# EAGLE design textdisplay (EAGLE 7.3.0)
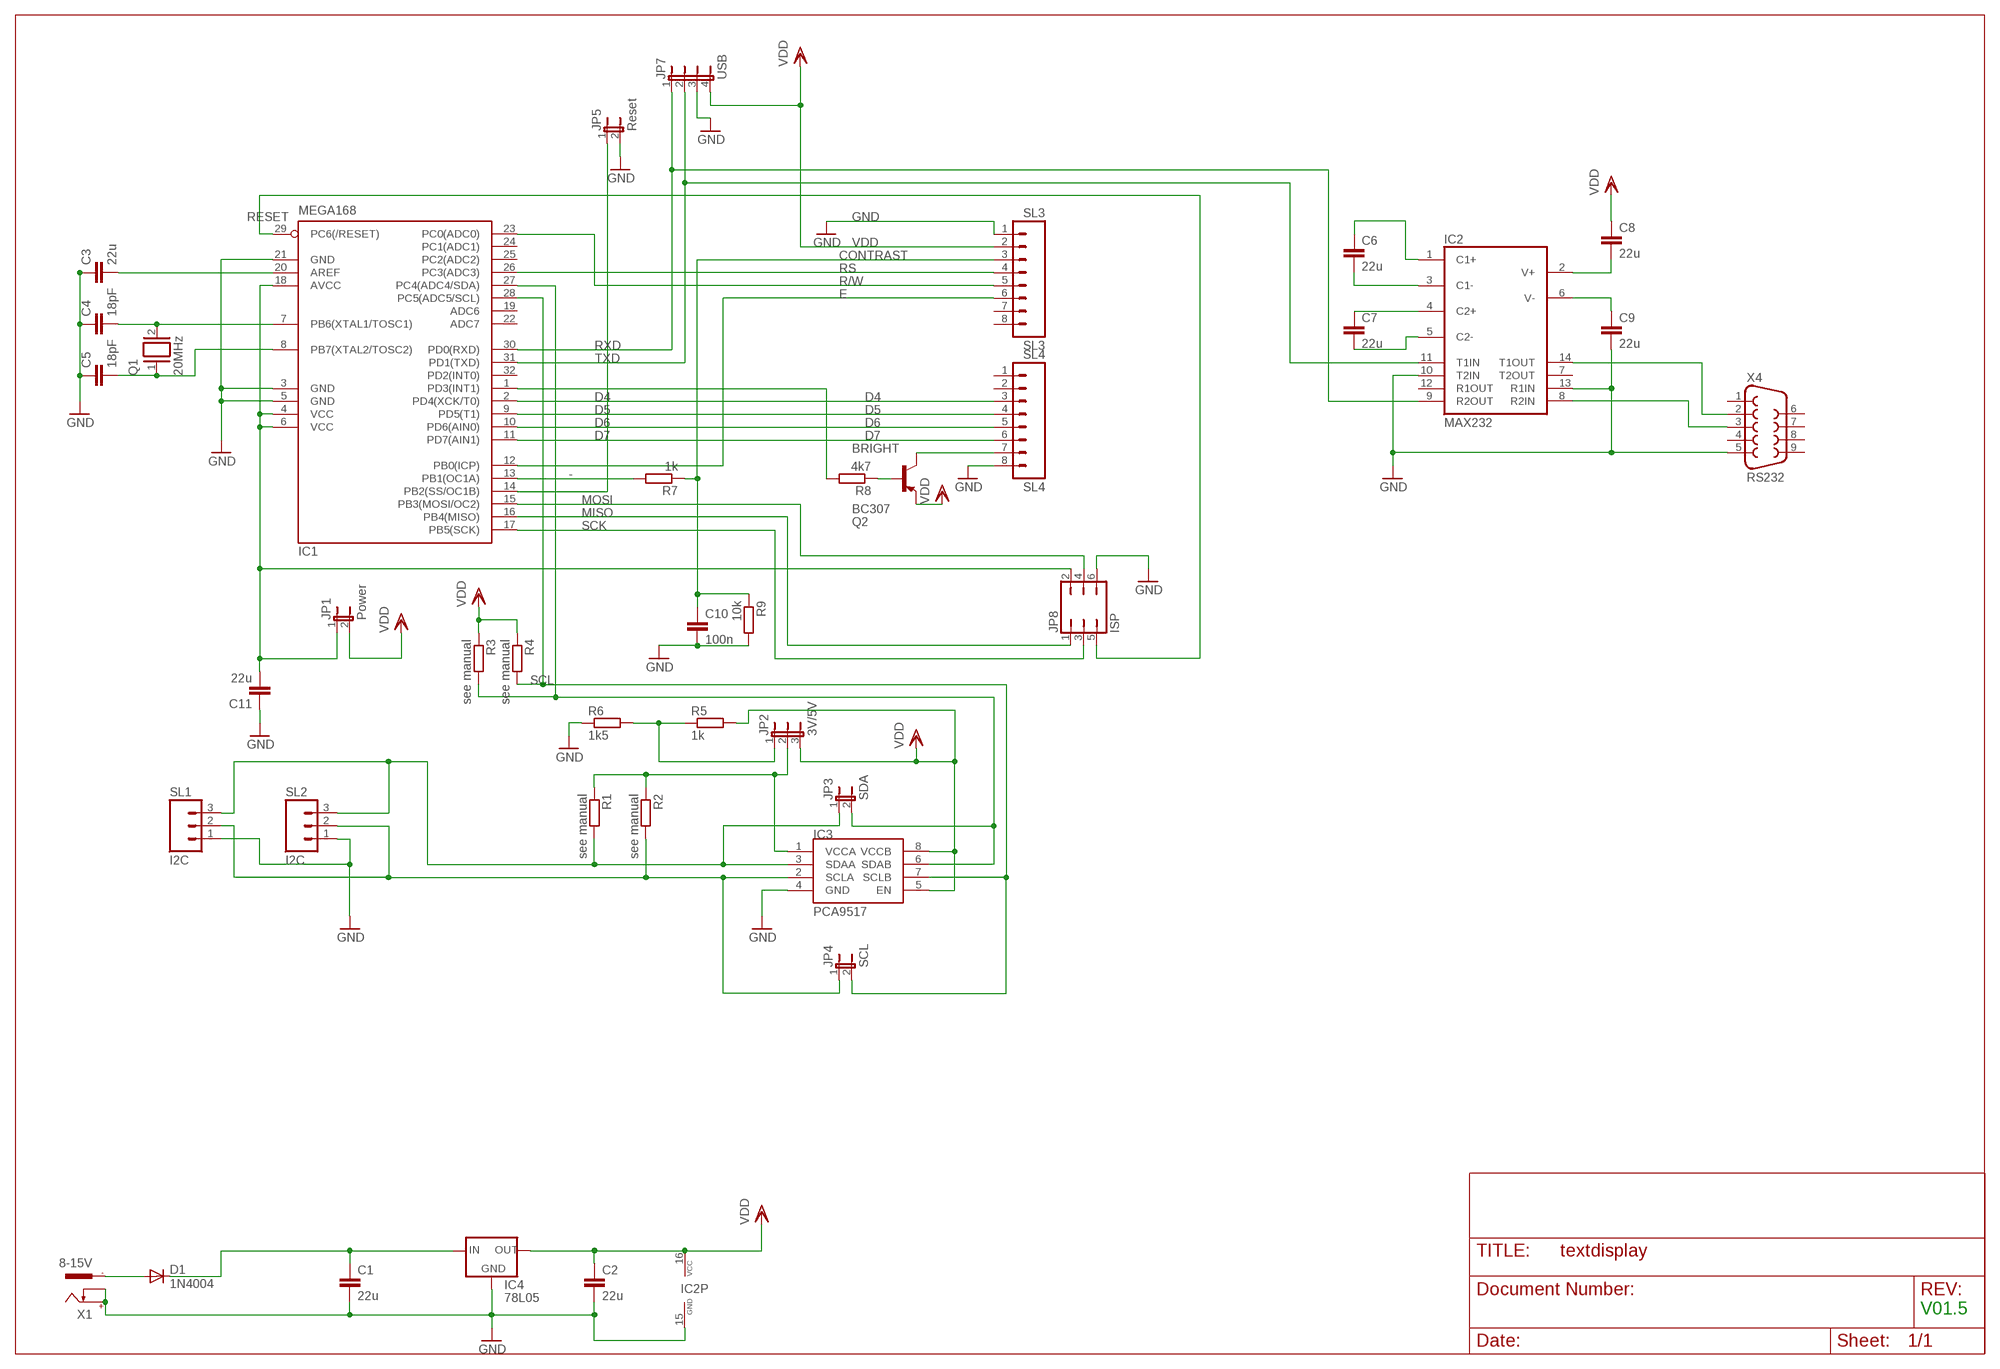
[diagram p0: schematic, sheet 1]

## Parts
C1  22u  C-EUC1206  [C1206]
C2  22u  C-EUC1206  [C1206]
C3  22u  C-EUC1206  [C1206]
C4  18pF  C-EU025-025X050  [C025-025X050]
C5  18pF  C-EU025-025X050  [C025-025X050]
C6  22u  C-EUC1206  [C1206]
C7  22u  C-EUC1206  [C1206]
C8  22u  C-EUC1206  [C1206]
C9  22u  C-EUC1206  [C1206]
C10  100n  C-EU050-025X075  [C050-025X075]
C11  22u  C-EUC1206  [C1206]
D1  1N4004  [DO41-10]
IC1  MEGA168  MEGA8-AI  [TQFP32-08]
IC2  MAX232  [DIL16]
IC3  PCA9517  [SO-08]
IC4  78L05  78LXX  [78LXX]
JP1  Power  JP1E  [JP1]
JP2  3V/5V  JP2E  [JP2]
JP3  SDA  JP1E  [JP1]
JP4  SCL  JP1E  [JP1]
JP5  Reset  JP1E  [JP1]
JP7  USB  JP4E  [JP4]
JP8  ISP  JP3Q  [JP3Q]
Q1  20MHz  XTAL/S  [QS]
Q2  BC307  [TO92]
R1  see manual  R-EU_R1206  [R1206]
R2  see manual  R-EU_R1206  [R1206]
R3  see manual  R-EU_R1206  [R1206]
R4  see manual  R-EU_R1206  [R1206]
R5  1k  R-EU_R1206  [R1206]
R6  1k5  R-EU_R1206  [R1206]
R7  1k  R-EU_R1206  [R1206]
R8  4k7  R-EU_R1206  [R1206]
R9  10k  R-EU_R1206  [R1206]
SL1  I2C  M03  [03P]
SL2  I2C  M03  [03P]
SL3  SL3  M08  [08P]
SL4  SL4  M08  [08P]
X1  8-15V  737992-55  [737992-5]
X4  RS232  F09H  [F09H]

## Nets
-: IC1.13(PB1(OC1A)) R7.2
BRIGHT: Q2.3(C) SL4.7
CONTRAST: C10.1 R7.1 R9.1 SL3.3
D4: IC1.2(PD4(XCK/T0)) SL4.3
D5: IC1.9(PD5(T1)) SL4.4
D6: IC1.10(PD6(AIN0)) SL4.5
D7: IC1.11(PD7(AIN1)) SL4.6
E: IC1.12(PB0(ICP)) SL3.6
GND: C1.2 C2.2 C3.1 C4.1 C5.1 C9.2 C10.2 C11.1 IC1.3(GND) IC1.5(GND) IC1.21(GND) IC2.10(T2IN) IC2.13(R1IN) IC2.15(GND) IC3.4(GND) IC4.GND JP5.2 JP7.3 JP8.6 R6.1 R9.2 SL1.1 SL2.1 SL3.1 SL4.8 X1.+ X1.K X4.5
MISO: IC1.16(PB4(MISO)) JP8.1
MOSI: IC1.15(PB3(MOSI/OC2)) JP8.4
N$1: JP2.1 R5.1 R6.2
N$2: IC1.1(PD3(INT1)) R8.2
N$3: IC3.3(SDAA) JP3.1 R1.2 SL1.3 SL2.3
N$4: Q2.2(B) R8.1
N$5: IC3.2(SCLA) JP4.1 R2.2 SL1.2 SL2.2
N$6: C11.2 IC1.4(VCC) IC1.6(VCC) IC1.18(AVCC) JP1.1 JP8.2
N$7: C6.2 IC2.3(C1-)
N$8: C7.1 IC2.4(C2+)
N$9: C7.2 IC2.5(C2-)
N$11: C9.1 IC2.6(V-)
N$12: C8.2 IC2.2(V+)
N$13: C6.1 IC2.1(C1+)
N$14: IC2.8(R2IN) X4.3
N$15: IC2.14(T1OUT) X4.2
N$16: IC1.14(PB2(SS/OC1B)) JP5.1
N$18: C1.1 D1.C IC4.IN
N$19: C4.2 IC1.7(PB6(XTAL1/TOSC1)) Q1.2
N$24: IC3.1(VCCA) JP2.2 R1.1 R2.1
N$25: D1.A X1.-1
N$35: C3.2 IC1.20(AREF)
N$37: C5.2 IC1.8(PB7(XTAL2/TOSC2)) Q1.1
R/W: IC1.23(PC0(ADC0)) SL3.5
RESET: IC1.29(PC6(/RESET)) JP8.5
RS: IC1.26(PC3(ADC3)) SL3.4
RXD: IC1.30(PD0(RXD)) IC2.9(R2OUT) JP7.1
SCK: IC1.17(PB5(SCK)) JP8.3
SCL: IC1.28(PC5(ADC5/SCL)) IC3.7(SCLB) JP4.2 R4.2
SDA: IC1.27(PC4(ADC4/SDA)) IC3.6(SDAB) JP3.2 R3.2
TXD: IC1.31(PD1(TXD)) IC2.11(T1IN) JP7.2
VDD: C2.1 C8.1 IC2.16(VCC) IC3.5(EN) IC3.8(VCCB) IC4.OUT JP1.2 JP2.3 JP7.4 Q2.1(E) R3.1 R4.1 R5.2 SL3.2
Unconnected: IC1.19(ADC6) IC1.22(ADC7) IC1.24(PC1(ADC1)) IC1.25(PC2(ADC2)) IC1.32(PD2(INT0)) IC2.7(T2OUT) IC2.12(R1OUT) SL3.7 SL3.8 SL4.1 SL4.2 X1.-2 X4.1 X4.4 X4.6 X4.7 X4.8 X4.9

## Notes on the sheet
- V01.5

## Library data of the parts
C1-C11 = resistor:C-EU: CAPACITOR, European symbol
D1 = diode:1N4004: DIODE general purpose rectifier, 1 A
IC1 = atmel:MEGA8: MICROCONTROLLER 8 Kbytes FLASH, 1 kbytes SRAM, 512 bytes EEPROM, USART, 6-channel 10 bit ADC, 2-channel 8 bit ADC Pin compatible with Atmega48, ATMega88, ATMega168 Source: avr.lbr; MPN: ATMEGA8-16AU; OC_FARNELL: 9171371; OC_NEWARK: 73M8863
IC2 = maxim:MAX232: RS232 TRANSCEIVER; MF: MAXIM; MPN: MAX232ACPE+; OC_FARNELL: 9723773; OC_NEWARK: 68K4544
IC3 = PCA9517:PCA9517: PCA9517
IC4 = v-reg:78LXX: VOLTAGE REGULATOR
JP1 JP3-JP5 = jumper:JP1E: JUMPER
JP2 = jumper:JP2E: JUMPER
JP7 = jumper:JP4E: JUMPER
JP8 = jumper:JP3Q: JUMPER
Q1 = special:XTAL/S: CRYSTAL
Q2 = transistor-pnp:BC307: PNP Transistor
R1-R9 = resistor:R-EU_: RESISTOR, European symbol
SL1 SL2 = con-amp-quick:M03: AMP QUICK CONNECTOR; OC_FARNELL: unknown; OC_NEWARK: unknown
SL3 SL4 = con-amp-quick:M08: AMP QUICK CONNECTOR; OC_FARNELL: unknown; OC_NEWARK: unknown
X1 = con-conrad:737992-55: FEMALE PRINT CONNECTOR DIN 45323 (34V/3A), ROKA, distributor Conrad
X4 = con-subd:F09: SUB-D; OC_FARNELL: unknown; OC_NEWARK: unknown

## Board
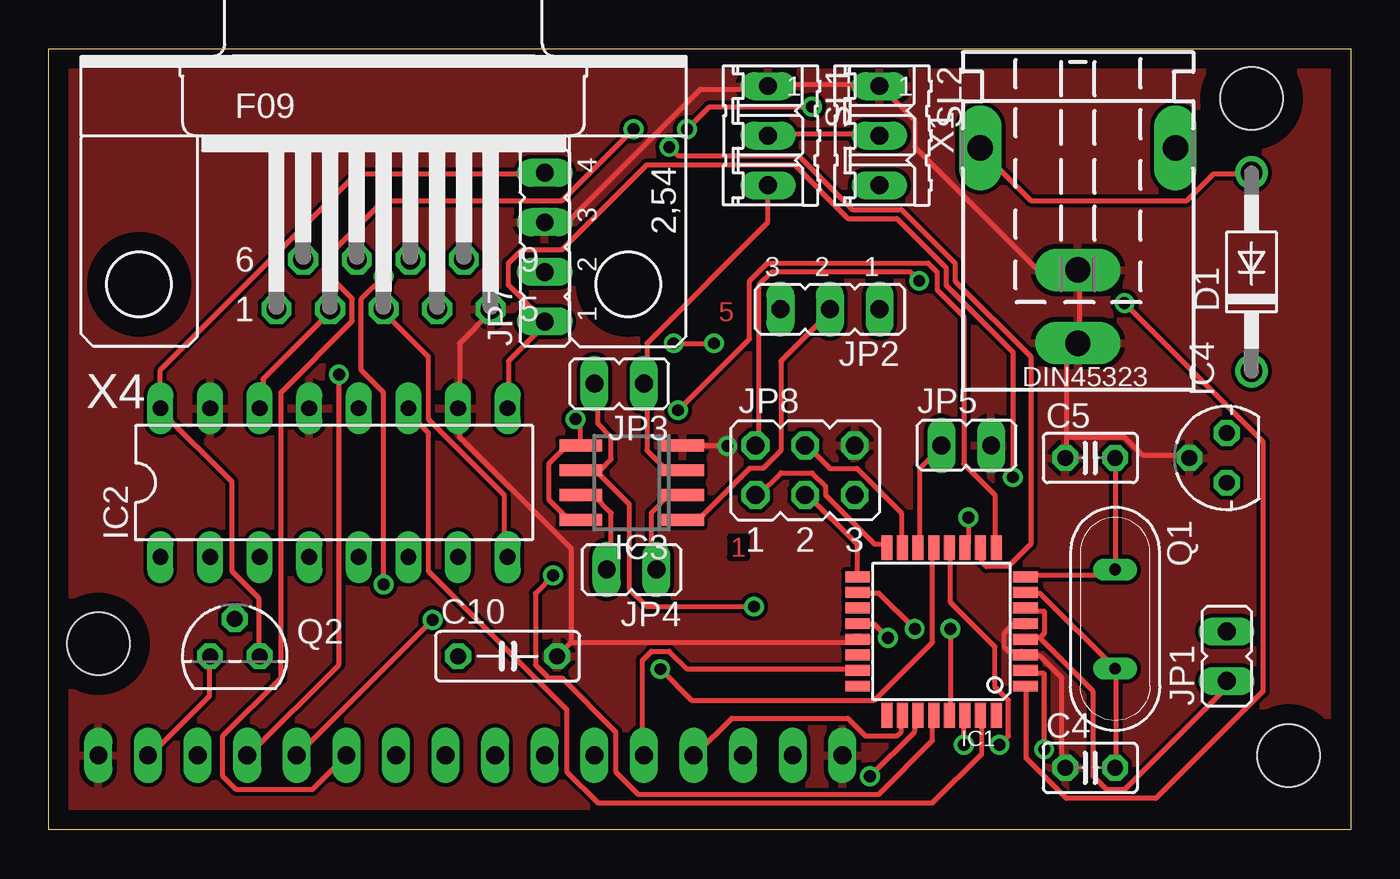
[diagram p1: board, top side]
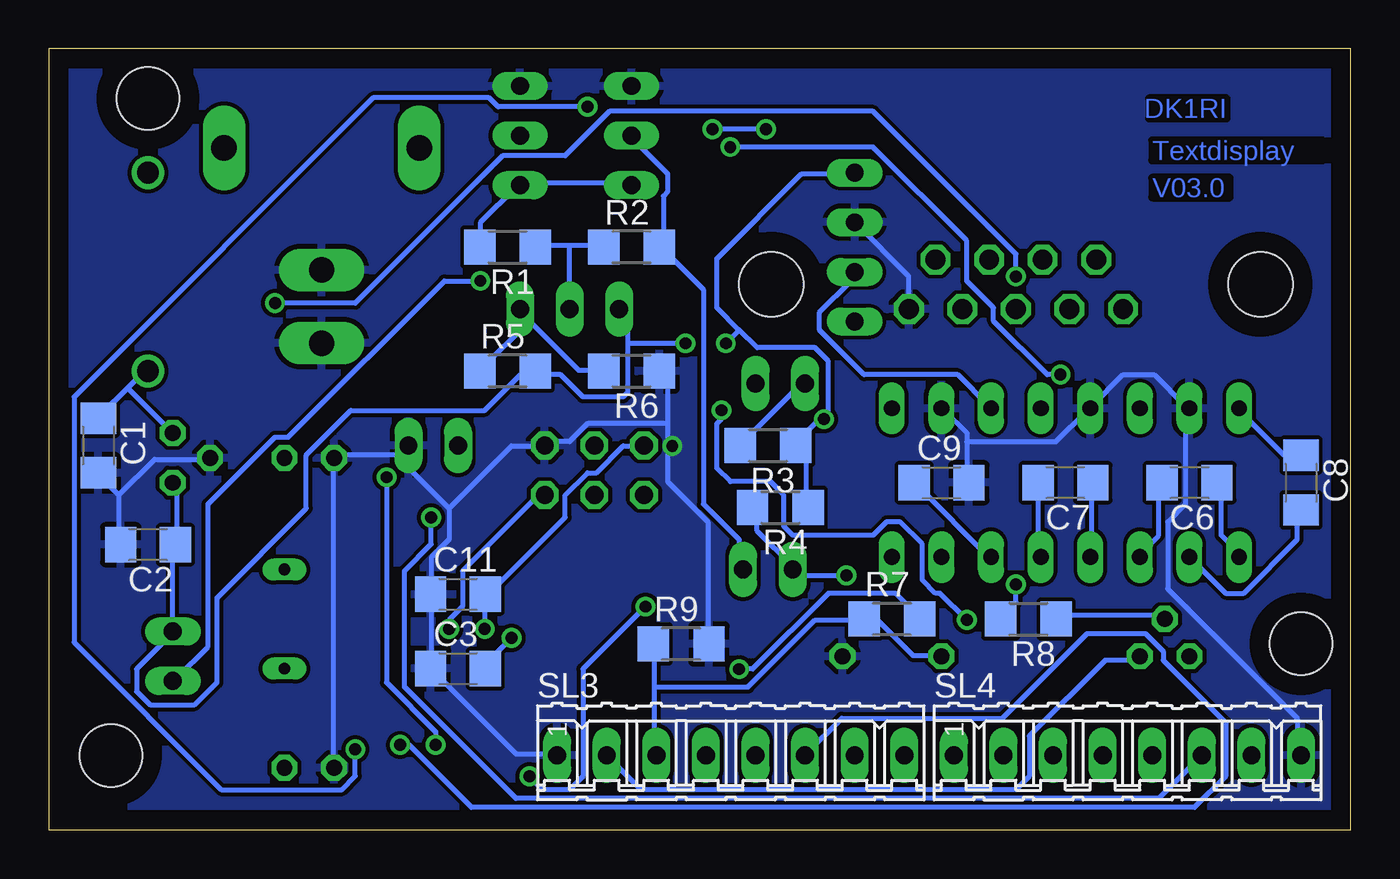
[diagram p2: board, bottom side, seen from below]

Size 66.67 x 40.01 mm. Coordinates in mm from the lower left corner, seen from the top.
Outline: 0,0 0,40.01 66.67,40.01 66.67,0 0,0
Copper layers (1*16): Top 0.035mm / dielectric 1.5mm / Bottom 0.035mm
Design rules "default": minimum track width 10mil, minimum drill 24mil, track to track 8mil, track to pad 8mil, pad to pad 8mil, via to via 8mil, smd to smd 8mil, copper to edge 40mil, drill to drill 8mil, minimum pad ring 10mil, minimum via ring 8mil, stop-mask expansion 4mil, vias tented up to drill 0mil, thermal gap 10mil
Holes 3.2 mm at 63.5,3.81 2.54,9.53 61.59,37.47

### Footprints (pad centres in the part's own frame; a part is rotated, then mirrored left to right if it is on the bottom)
C1206 = smd 1.6 x 1.8: 1 -1.4,0; 2 1.4,0
C025-025X050 = drill 0.813 octagon: 1 -1.27,0; 2 1.27,0
C050-025X075 = drill 0.813 octagon: 1 -2.54,0; 2 2.54,0
DO41-10 = drill 1.118: A 5.08,0; C -5.08,0
TQFP32-08 = smd 1.27 x 0.559: 1 -4.293,2.8; 2 -4.293,2; 3 -4.293,1.2; 4 -4.293,0.4; 5 -4.293,-0.4; 6 -4.293,-1.2; 7 -4.293,-2; 8 -4.293,-2.8; 17 4.293,-2.8; 18 4.293,-2; 19 4.293,-1.2; 20 4.293,-0.4; 21 4.293,0.4; 22 4.293,1.2; 23 4.293,2; 24 4.293,2.8 | smd 0.559 x 1.27: 9 -2.8,-4.293; 10 -2,-4.293; 11 -1.2,-4.293; 12 -0.4,-4.293; 13 0.4,-4.293; 14 1.2,-4.293; 15 2,-4.293; 16 2.8,-4.293; 25 2.8,4.293; 26 2,4.293; 27 1.2,4.293; 28 0.4,4.293; 29 -0.4,4.293; 30 -1.2,4.293; 31 -2,4.293; 32 -2.8,4.293
DIL16 = drill 0.813 long: 1 -8.89,-3.81; 2 -6.35,-3.81; 3 -3.81,-3.81; 4 -1.27,-3.81; 5 1.27,-3.81; 6 3.81,-3.81; 7 6.35,-3.81; 8 8.89,-3.81; 9 8.89,3.81; 10 6.35,3.81; 11 3.81,3.81; 12 1.27,3.81; 13 -1.27,3.81; 14 -3.81,3.81; 15 -6.35,3.81; 16 -8.89,3.81
SO-08 = smd 0.6 x 2.2: 1 -1.905,-2.6; 2 -0.635,-2.6; 3 0.635,-2.6; 4 1.905,-2.6; 5 1.905,2.6; 6 0.635,2.6; 7 -0.635,2.6; 8 -1.905,2.6
78LXX = drill 0.813 octagon: GND 0,1.905; IN 1.27,0; OUT -1.27,0
JP1 = drill 0.914 long: 1 0,-1.27; 2 0,1.27
JP2 = drill 0.914 long: 1 -2.54,0; 2 0,0; 3 2.54,0
JP4 = drill 0.914 long: 1 -3.81,0; 2 -1.27,0; 3 1.27,0; 4 3.81,0
JP3Q = drill 0.914 octagon: 1 -2.54,-1.27; 2 -2.54,1.27; 3 0,-1.27; 4 0,1.27; 5 2.54,-1.27; 6 2.54,1.27
QS = drill 0.61 long: 1 -2.54,0; 2 2.54,0
TO92 = drill 0.813 octagon: 1 1.27,0; 2 0,1.905; 3 -1.27,0
R1206 = smd 1.6 x 1.803: 1 -1.422,0; 2 1.422,0
03P = drill 0.914 long: 1 -2.54,0; 2 0,0; 3 2.54,0
08P = drill 0.914 long: 1 -8.89,0; 2 -6.35,0; 3 -3.81,0; 4 -1.27,0; 5 1.27,0; 6 3.81,0; 7 6.35,0; 8 8.89,0
737992-5 = drill 1.3 pad 2.184 long: + 0,10; -1 5,0; -2 -5,0; K 0,6.25
F09H = drill 1.016 octagon: 1 -5.486,-1.27; 2 -2.743,-1.27; 3 0,-1.27; 4 2.743,-1.27; 5 5.486,-1.27; 6 -4.115,1.27; 7 -1.372,1.27; 8 1.372,1.27; 9 4.115,1.27 | hole 3.302: -12.522,0; 12.522,0

### Placement (x,y rotation side)
C1  64.14,19.68 270 bottom
C2  61.59,14.61 180 bottom
C3  45.72,8.26 0 bottom
C4  53.34,3.17 0 top
C5  53.34,19.05 0 top
C6  8.26,17.78 180 bottom
C7  14.61,17.78 180 bottom
C8  2.54,17.78 270 bottom
C9  20.95,17.78 0 bottom
C10  23.5,8.89 0 top
C11  45.72,12.06 0 bottom
D1  61.59,28.57 90 top
IC1  45.72,10.16 180 top
IC2  14.61,17.78 0 top
IC3  29.84,17.78 90 top
IC4  60.33,19.05 90 top
JP1  60.33,8.89 0 top
JP2  40.01,26.67 180 top
JP3  29.21,22.86 90 top
JP4  29.84,13.34 90 top
JP5  46.99,19.68 270 top
JP7  25.4,29.84 90 top
JP8  38.73,18.41 0 top
Q1  54.61,10.79 270 top
Q2  9.53,8.89 0 top
R1  43.18,29.84 180 bottom
R2  36.83,29.84 0 bottom
R3  29.84,19.68 180 bottom
R4  29.21,16.51 180 bottom
R5  43.18,23.5 0 bottom
R6  36.83,23.5 180 bottom
R7  23.5,10.79 0 bottom
R8  16.51,10.79 180 bottom
R9  34.29,9.53 0 bottom
SL1  36.83,35.56 270 top
SL2  42.55,35.56 270 top
SL3  31.75,3.81 0 bottom
SL4  11.43,3.81 0 bottom
X1  52.7,34.92 180 top
X4  17.14,27.94 0 top

### Tracks (layer width: path | path; a pad name or v marks a point on that pad's centre or on a via)
-  (via drill 0.61)
  Top 0.254: v31.32,8.23 32.92,6.63 42.29,6.63 45.26,9.6 45.26,14.4 IC1.13
  Bottom 0.254: v31.32,8.23 30.63,8.23 26.75,12.12 23.32,12.12 22.17,10.97 R7.2
BRIGHT
  Top 0.254: Q2.3 8.23,8.69 8.23,6.86 5.26,3.89 SL4.7
CONTRAST
  Bottom 0.254: C10.1 21.03,8.91 22.4,8.91 24.23,10.74 24.69,10.74 R7.1 24.92,10.74 27.43,10.74 30.86,7.32 35.66,7.32 | 35.66,7.32 35.66,3.89 SL3.3 | 35.66,7.32 35.66,9.37 R9.1
D4  (via drill 0.61)
  Top 0.254: v50.98,4.12 50.98,8 50.06,8 IC1.2 | v39.09,37.03 33.83,37.03 v32.69,35.89 | v29.95,35.89 26.29,32.23 17.14,32.23 14.63,29.72 14.63,28.12 15.54,27.2 15.54,26.06 11.89,22.4 11.89,7.77 8.91,4.8 8.91,2.74 9.6,2.06 13.49,2.06 SL4.3
  Bottom 0.254: v50.98,4.12 50.98,2.74 51.66,2.06 57.84,2.06 65.38,9.6 65.38,22.17 50.06,37.49 44.12,37.49 43.66,37.03 v39.09,37.03 | v29.95,35.89 v32.69,35.89
D5  (via drill 0.61)
  Top 0.254: v32.23,21.49 35.89,25.15 35.89,28.12 36.8,29.03 45.03,29.03 45.49,28.57 45.49,27.66 46.86,26.29 46.86,18.75 48.46,17.14 48.46,14.63 IC1.9 | v19.66,10.74 12.8,3.89 SL4.4
  Bottom 0.254: v32.23,21.49 32.23,21.03 32.46,20.8 32.46,18.52 31.77,17.83 29.72,17.83 29.03,17.14 29.03,15.54 28.57,15.09 24.46,15.09 23.77,15.77 23.09,15.77 21.95,14.63 21.95,12.8 21.26,12.12 21.03,12.12 v19.66,10.74
D6  (via drill 0.61)
  Top 0.254: v31.77,34.98 32.23,34.52 38.41,34.52 41.15,31.77 43.66,31.77 46.41,29.03 46.41,28.12 50.29,24.23 50.29,14.63 49.15,13.49 48.01,13.49 47.78,13.72 47.78,14.4 IC1.10 | v14.86,23.32 14.86,8.46 10.29,3.89 SL4.5
  Bottom 0.254: v31.77,34.98 24.46,34.98 19.66,30.18 19.66,28.12 18.29,26.75 18.29,26.06 15.54,23.32 v14.86,23.32
D7  (via drill 0.61)
  Top 0.254: v47.09,16 47.09,14.63 IC1.11
  Bottom 0.254: v47.09,16 47.09,14.63 48.46,13.26 48.46,7.32 42.75,1.6 9.83,1.6 SL4.6
E  (via drill 0.61)
  Top 0.254: v48.69,4.34 49.15,4.8 49.15,6.63 48.46,7.32 48.46,9.37 46.18,11.66 46.18,14.4 IC1.12
  Bottom 0.254: v48.69,4.34 48.23,4.34 45.03,1.14 8,1.14 6.4,2.74 6.4,5.49 9.6,8.69 9.6,9.14 10.52,10.06 13.49,10.06 17.83,5.71 26.06,5.71 27.89,3.89 SL3.6
GND  (via drill 0.61)
  Top 0.254: v34.75,19.66 32.46,19.66 IC3.4 | IC1.5 49.84,10.52 49.38,10.52 48.92,10.06 48.92,9.37 49.15,9.14 49.84,9.14 IC1.3 50.06,8.91 50.75,8.91 51.89,7.77 51.89,3.2 C4.1 | 52.12,20.12 52.12,24.46 52.58,24.92 X1.+ 52.81,25.15 52.81,28.57 X1.K 52.58,28.8 50.52,28.8 44.35,34.98 44.35,36.35 42.75,37.95 SL2.1 42.52,38.18 37.03,38.18 SL1.1 36.8,37.95 33.38,37.95 26.75,31.32 25.6,31.32 JP7.3 | 52.12,20.12 52.12,19.2 C5.1 | 52.12,20.12 55.09,20.12 56.01,19.2 58.29,19.2 IC4.GND | 26.75,9.6 41.38,9.6 IC1.21 | C10.2 26.75,9.6 | X4.5 22.63,26.52 21.03,24.92 21.03,21.72 IC2.10 21.03,21.49 21.03,20.12 26.75,14.4 26.75,9.6
  Bottom 0.254: 34.98,20.8 34.98,23.09 35.2,23.32 R6.1 | 34.98,20.8 34.98,19.66 | 34.98,19.66 34.98,17.83 32.92,15.77 32.92,9.6 R9.2 | 34.98,19.66 v34.75,19.66 | 34.98,20.8 39.09,20.8 40.01,19.89 41.15,19.89 JP8.6 41.38,19.66 42.98,19.66 46.18,16.46 | SL3.1 40.69,3.89 42.75,3.89 47.09,8.23 C3.1 47.09,8.46 47.09,11.89 C11.1 47.09,12.12 47.09,13.95 46.18,14.86 46.18,16.46 | 63.09,17.14 63.09,14.63 C2.2 | 63.09,17.14 64.01,18.06 C1.2 | 63.09,17.14 61.27,18.97 58.52,18.97 IC4.GND | 48.92,19.2 51.89,19.2 C5.1 52.12,18.97 52.12,3.2 C4.1 | 48.92,19.2 48.46,19.66 JP5.2 48.92,19.2 | 48.92,19.2 46.18,16.46 | SL4.8 2.74,3.89 2.74,5.71 9.37,12.34 9.37,15.77 8.46,16.69 8.46,21.49 IC2.15 8.46,21.72 10.06,23.32 11.66,23.32 13.26,21.72 IC2.13 13.49,21.49 15.09,19.89 19.66,19.89 | 19.66,19.89 19.66,20.34 20.8,21.49 IC2.10 | 19.66,19.89 19.66,17.83 C9.2 | JP7.3 22.63,28.35 X4.5
  pour Top: 0.64,39.37 66.04,39.37 66.04,0.64 0.64,0.64
  pour Bottom: 0.64,39.37 66.04,39.37 66.04,0.64 0.64,0.64
MISO
  Top 0.254: IC1.16 42.75,14.63 42.29,14.63 39.78,17.14 39.78,17.6 39.09,18.29 37.49,18.29 36.35,17.14 JP8.1
MOSI
  Top 0.254: IC1.15 43.66,14.63 43.66,16.23 41.38,18.52 40.01,18.52 38.86,19.66 JP8.4
N$1
  Bottom 0.254: 42.06,26.06 42.52,26.52 JP2.1 42.06,26.06 | 42.06,26.06 39.55,23.55 38.41,23.55 R6.2 | 42.06,26.06 44.58,23.55 R5.1
N$2  (via drill 0.61)
  Top 0.254: v55.09,26.98 62.18,19.89 62.18,7.09 56.69,1.6 52.12,1.6 50.06,3.66 50.06,7.32 IC1.1 | v17.14,28.35 16,27.2 16,23.55 17.14,22.4 v17.14,12.57
  Bottom 0.254: v55.09,26.98 50.98,26.98 43.43,34.52 40.23,34.52 37.95,36.8 24.46,36.8 17.14,29.49 v17.14,28.35 | v17.14,12.57 17.14,11.66 17.83,10.97 R8.2
N$3
  Top 0.254: 30.63,22.86 30.63,19.43 31.55,18.52 32.23,18.52 IC3.3 | 30.63,22.86 30.63,24.92 36.8,31.09 36.8,32.92 SL1.3 | 30.63,22.86 JP3.1
  Bottom 0.254: R1.2 44.58,29.95 44.58,31.09 42.75,32.92 SL2.3 42.52,33.15 37.03,33.15 SL1.3
N$4
  Bottom 0.254: R8.1 15.09,10.97 9.6,10.97 Q2.2
N$5
  Top 0.254: IC3.2 31.77,17.14 30.86,16.23 30.86,13.72 31.09,13.49 JP4.1 | SL2.2 42.52,35.66 37.03,35.66 SL1.2
  Bottom 0.254: SL1.2 36.8,35.43 34.98,33.6 34.98,32.69 35.2,32.46 35.2,29.95 R2.2 35.2,29.72 33.15,27.66 33.15,16.69 31.32,14.86 31.32,13.49 JP4.1
N$6  (via drill 0.61)
  Top 0.254: v44.35,10.29 42.52,12.12 41.6,12.12 IC1.18 | 50.75,9.83 50.06,9.83 IC1.4 | 50.75,9.83 50.98,10.06 50.98,11.2 50.06,11.2 IC1.6 | 50.75,9.83 53.49,7.09 53.49,2.74 54.18,2.06 55.09,2.06 60.12,7.09 60.12,7.54 JP1.1 | v44.58,28.12 44.12,28.57 37.03,28.57 36.35,27.89 36.35,19.89 JP8.2
  Bottom 0.254: v44.35,10.29 44.35,11.89 C11.2 44.12,12.12 40.23,16 40.23,17.14 39.09,18.29 38.63,18.29 37.26,19.66 36.35,19.66 JP8.2 | v44.58,28.12 46.41,28.12 54.41,20.12 55.09,20.12 58.52,16.69 58.52,9.37 60.12,7.77 JP1.1
N$7
  Bottom 0.254: C6.2 9.83,17.6 9.83,15.09 10.74,14.17 IC2.3
N$8
  Bottom 0.254: C7.1 13.26,17.6 13.26,14.17 IC2.4
N$9
  Bottom 0.254: C7.2 16,17.6 16,14.17 IC2.5
N$11
  Bottom 0.254: C9.1 22.17,17.6 18.52,13.95 IC2.6
N$12
  Bottom 0.254: IC2.2 6.4,12.12 5.49,12.12 2.74,14.86 2.74,16.23 C8.2
N$13
  Bottom 0.254: C6.1 6.63,17.6 6.63,15.09 5.71,14.17 IC2.1
N$14
  Top 0.254: IC2.8 23.32,14.17 23.32,17.14 19.43,21.03 19.43,24.23 17.14,26.52 X4.3
N$15
  Top 0.254: IC2.14 10.97,21.72 10.97,23.09 14.4,26.52 X4.2
N$16
  Top 0.254: IC1.14 44.58,14.63 44.58,18.52 45.72,19.66 JP5.1
N$18
  Bottom 0.254: 62.64,22.63 61.72,23.55 D1.C | 62.64,22.63 64.01,21.26 C1.1 | 62.64,22.63 IC4.IN
N$19
  Top 0.254: IC1.7 50.06,12.12 50.75,12.12 Q1.2 54.63,8.23 54.63,3.2 C4.2
N$24
  Top 0.254: IC3.1 32.46,16 33.38,16 35.89,18.52 36.58,18.52 37.49,19.43 37.49,24 40.01,26.52 JP2.2
  Bottom 0.254: 40.01,29.95 41.6,29.95 R1.1 | 40.01,29.95 38.41,29.95 R2.1 | JP2.2 40.01,29.95
N$25
  Top 0.254: D1.A 61.49,33.6 59.66,33.6 58.29,32.23 50.29,32.23 47.78,34.75 X1.-1
N$35  (via drill 0.61)
  Top 0.254: v42.98,9.83 42.29,10.52 41.6,10.52 IC1.20
  Bottom 0.254: v42.98,9.83 44.35,8.46 C3.2
N$37
  Top 0.254: IC1.8 50.06,13.03 54.18,13.03 54.41,13.26 Q1.1 54.63,13.49 54.63,18.97 C5.2
R/W
  Top 0.254: IC1.23 41.38,8.23 32.69,8.23 31.77,9.14 30.86,9.14 30.4,8.69 30.4,3.89 SL3.5
RESET  (via drill 0.61)
  Top 0.254: v46.18,10.29 46.18,5.94 IC1.29
  Bottom 0.254: v46.18,10.29 46.18,10.74 45.49,11.43 45.49,13.26 41.6,17.14 JP8.5
RS
  Top 0.254: IC1.26 43.66,5.71 43.66,5.03 43.43,4.8 41.83,4.8 40.92,5.71 34.98,5.71 33.15,3.89 SL3.4
RXD  (via drill 0.61)
  Top 0.254: v46.86,4.34 46.86,5.71 IC1.30 | v49.38,18.06 49.38,24.46 45.95,27.89 45.95,28.8 43.43,31.32 40.92,31.32 38.18,34.06 30.63,34.06 26.29,29.72 24.23,29.72 23.55,29.03 23.55,27.89 JP7.1 25.38,25.83 23.55,24 23.55,21.72 IC2.9
  Bottom 0.254: v46.86,4.34 46.86,5.03 49.38,7.54 v49.38,18.06
SCK
  Top 0.254: IC1.17 41.38,13.03 41.38,14.63 38.86,17.14 JP8.3
SCL  (via drill 0.61)
  Top 0.254: v25.83,13.03 24.92,12.12 24.92,8.46 25.6,7.77 26.29,7.77 29.03,5.03 29.03,2.97 30.18,1.83 42.52,1.83 45.26,4.57 45.26,5.71 IC1.28 | IC3.7 27.89,17.14 28.8,16.23 28.8,13.72 28.57,13.49 JP4.2
  Bottom 0.254: v25.83,13.03 28.35,13.03 28.57,13.26 JP4.2 28.57,13.49 30.4,15.32 30.4,16.46 R4.2
SDA  (via drill 0.61)
  Top 0.254: v42.06,2.74 44.35,5.03 44.35,5.71 IC1.27 | v36.12,11.43 30.63,11.43 29.72,12.34 29.72,16.69 28.12,18.29 | 28.12,18.29 27.43,18.29 IC3.6 28.12,18.29 | 28.12,18.29 28.8,18.97 28.8,20.12 28.12,20.8 28.12,22.86 JP3.2
  Bottom 0.254: R3.2 31.09,19.89 28.12,22.86 JP3.2 | v42.06,2.74 41.38,2.06 40.01,2.06 39.32,2.74 39.32,8.23 v36.12,11.43
TXD
  Top 0.254: IC1.31 47.78,5.71 47.78,3.89 45.26,1.37 28.12,1.37 26.52,2.97 26.52,6.17 19.43,13.26 19.43,20.34 18.29,21.49 IC2.11
  Bottom 0.254: JP7.2 25.6,28.57 25.6,28.12 27.2,26.52 27.2,25.6 24.92,23.32 20.12,23.32 18.52,21.72 IC2.11
VDD  (via drill 0.61)
  Top 0.254: IC3.8 27.2,16 26.52,16 25.6,16.92 25.6,18.75 26.52,19.66 27.2,19.66 IC3.5 27.2,19.89 27.2,20.8 v26.98,21.03 | Q2.1 10.74,8.91 10.74,11.89 9.37,13.26 9.37,17.83 5.71,21.49 IC2.16 5.71,23.55 15.77,33.6 25.38,33.6 JP7.4 | v32,24.92 v34.06,24.92
  Bottom 0.254: 37.03,24.92 37.03,26.29 37.26,26.52 JP2.3 | 37.03,24.92 37.03,22.4 37.26,22.17 39.32,22.17 40.46,23.32 41.6,23.32 R5.2 41.83,23.32 42.52,23.32 44.35,21.49 51.21,21.49 53.49,19.2 53.49,16.46 58.06,11.89 58.06,7.54 59.21,6.4 61.49,6.4 62.18,7.09 62.18,8.23 60.35,10.06 JP1.2 60.35,10.29 60.35,14.4 C2.1 60.12,14.63 60.12,17.6 IC4.OUT | R4.1 27.89,16.69 27.89,19.2 28.35,19.66 R3.1 28.35,19.89 26.98,21.26 | 31.32,25.6 30.4,24.69 27.43,24.69 26.75,24 26.75,21.49 26.98,21.26 | 31.32,25.6 32.46,26.75 32.46,29.26 28.12,33.6 25.6,33.6 JP7.4 | 26.98,21.26 v26.98,21.03 | C8.1 2.74,19.2 3.43,19.2 5.71,21.49 IC2.16 | SL3.2 36.35,2.06 17.14,2.06 16.46,2.74 16.46,4.8 12.57,8.69 10.97,8.69 Q2.1 | v34.06,24.92 37.03,24.92 | 31.32,25.6 v32,24.92

### Text on the board
Top: 5 | 1
Bottom: DK1RI | Textdisplay | V03.0